# EasyEDA schematic SCH_chemical bro_2022-05-06.json
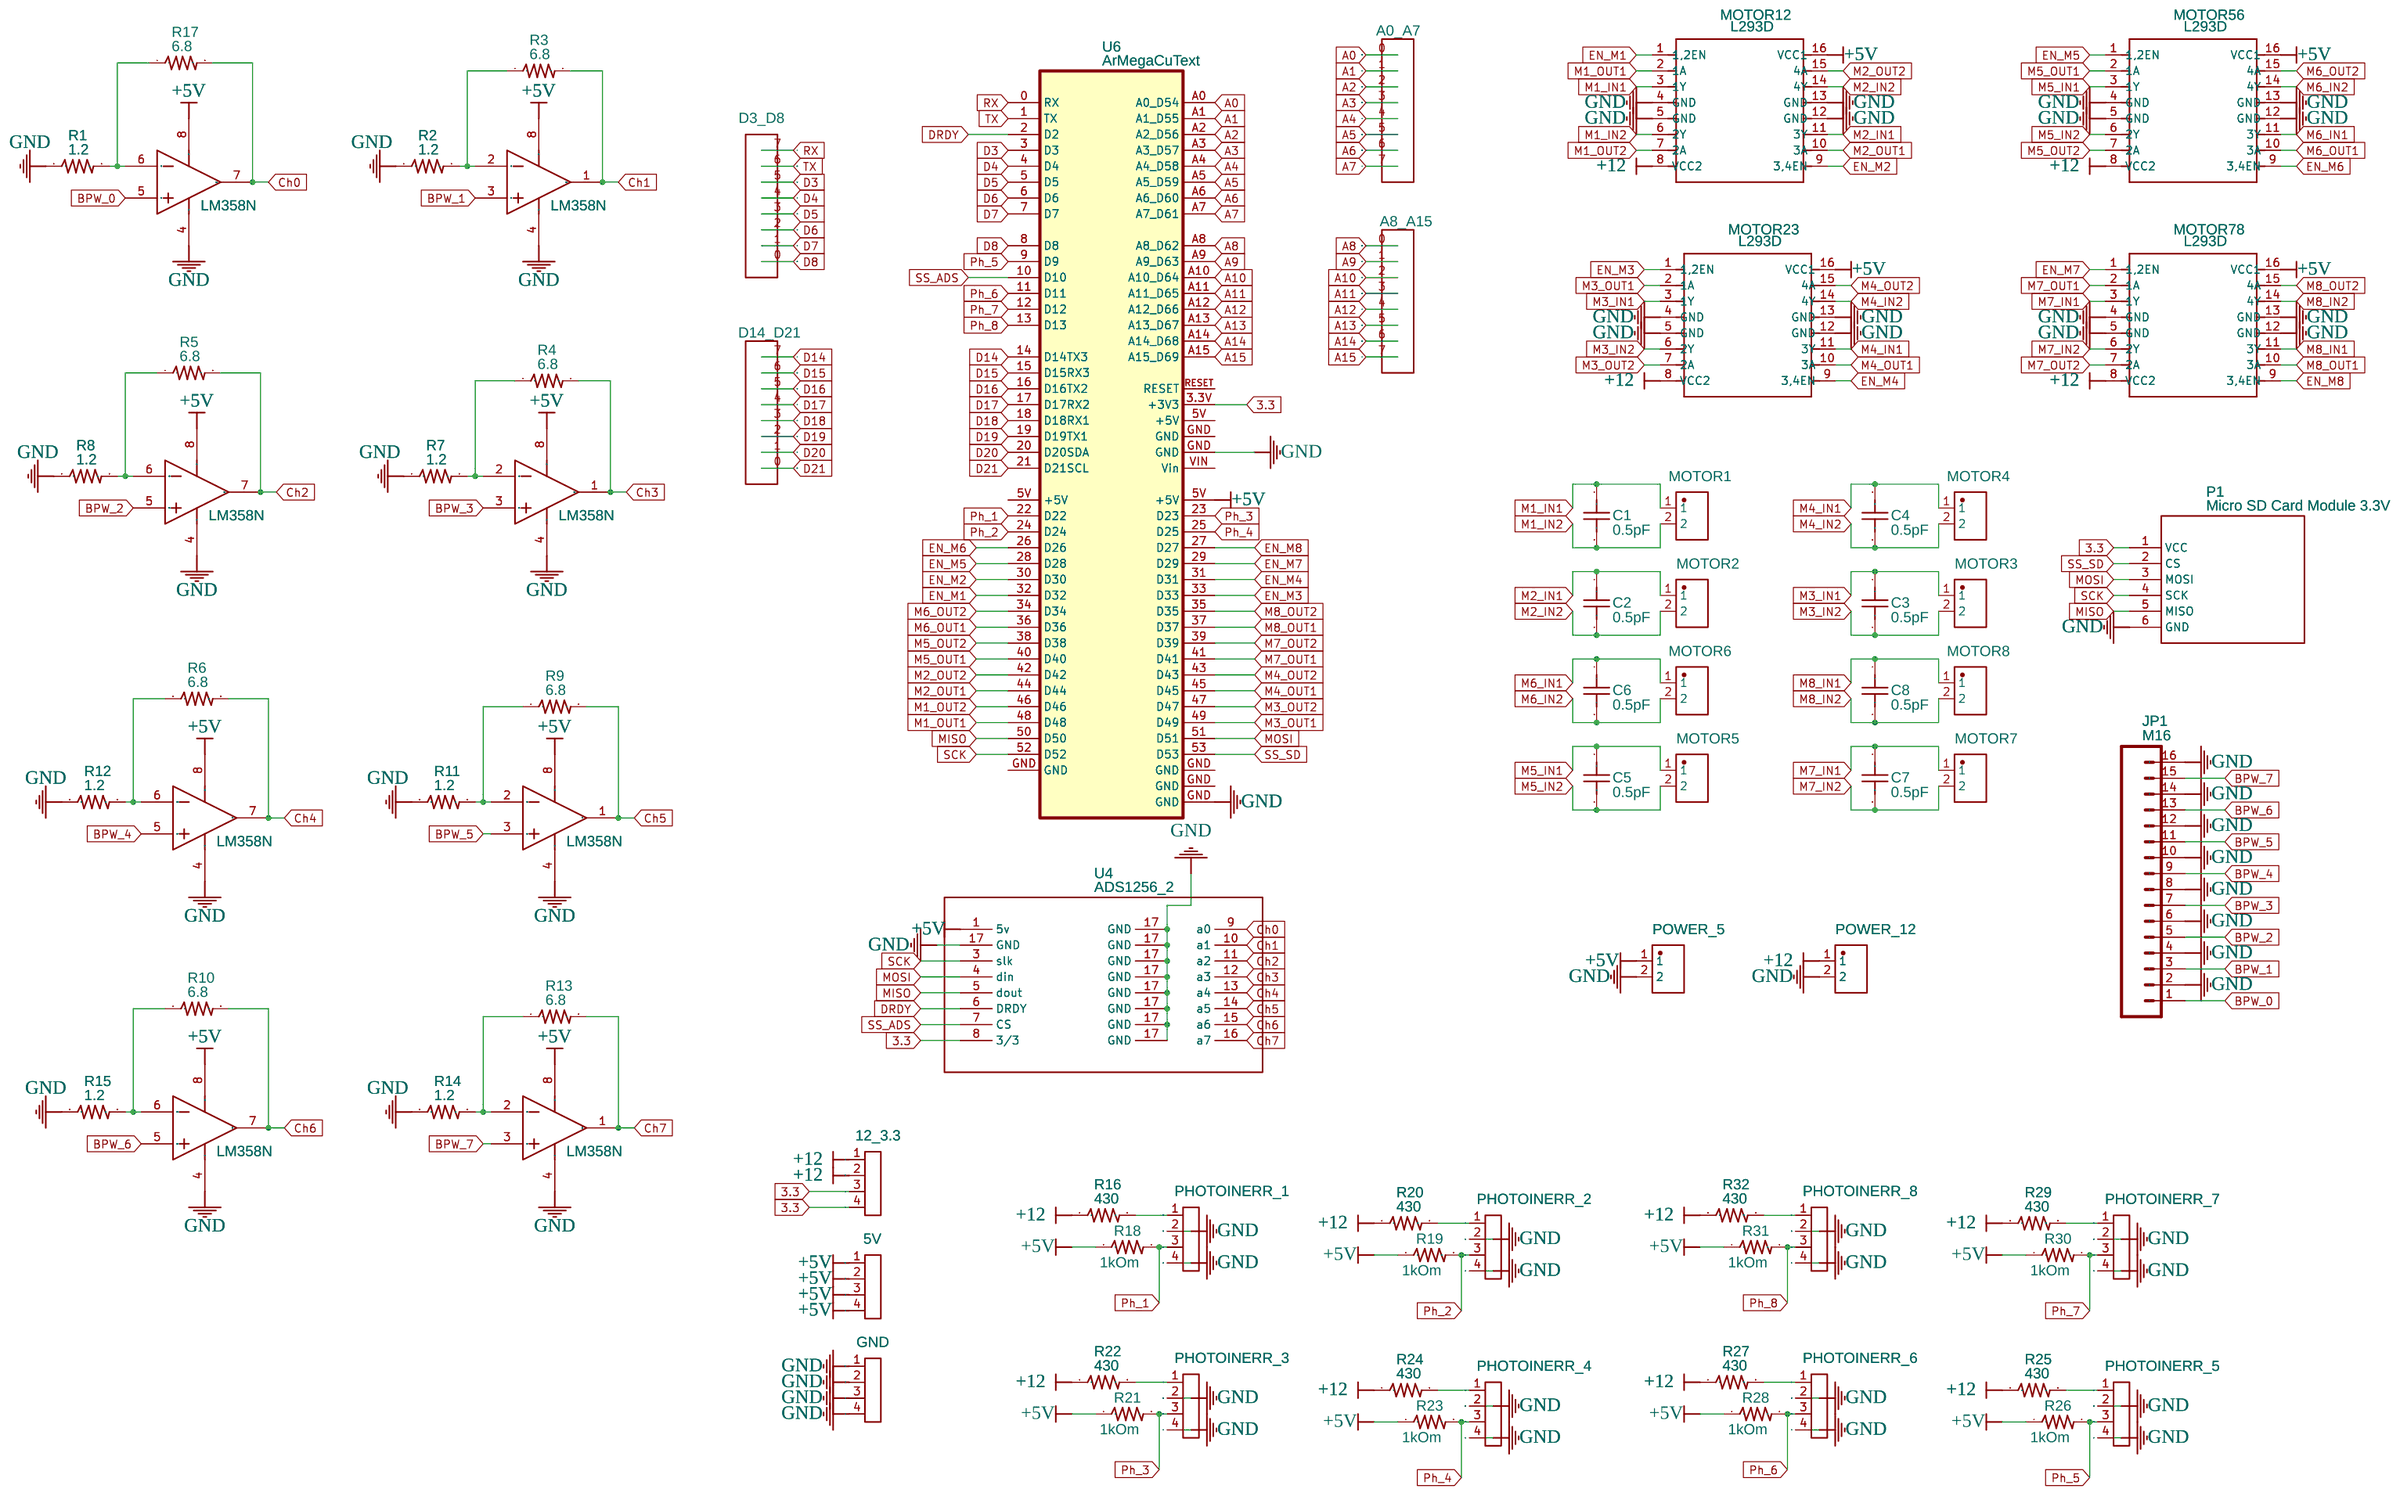
[diagram p0: schematic sheet]

## Parts
5V  pin4  [PIN4]
12_3  pin4  [PIN4]  (section 3)
A0_A7  pin8  [PIN8]
A8_A15  pin8  [PIN8]
C1  0.5pF  [CAP-TH_L5.5-W4.0-P2.50-D1.0]
C2  0.5pF  [CAP-TH_L5.5-W4.0-P2.50-D1.0]
C3  0.5pF  [CAP-TH_L5.5-W4.0-P2.50-D1.0]
C4  0.5pF  [CAP-TH_L5.5-W4.0-P2.50-D1.0]
C5  0.5pF  [CAP-TH_L5.5-W4.0-P2.50-D1.0]
C6  0.5pF  [CAP-TH_L5.5-W4.0-P2.50-D1.0]
C7  0.5pF  [CAP-TH_L5.5-W4.0-P2.50-D1.0]
C8  0.5pF  [CAP-TH_L5.5-W4.0-P2.50-D1.0]
D3_D8  pin8  [PIN8]
D14_D21  pin8  [PIN8]
GND  pin4  [PIN4]
JP1  M16  [1X16_LONGPADS]
MOTOR1  DG125-5.0-02P-14-00A(H)  [CONN-TH_DG125-5.0-02P-14-00A]
MOTOR2  DG125-5.0-02P-14-00A(H)  [CONN-TH_DG125-5.0-02P-14-00A]
MOTOR3  DG125-5.0-02P-14-00A(H)  [CONN-TH_DG125-5.0-02P-14-00A]
MOTOR4  DG125-5.0-02P-14-00A(H)  [CONN-TH_DG125-5.0-02P-14-00A]
MOTOR5  DG125-5.0-02P-14-00A(H)  [CONN-TH_DG125-5.0-02P-14-00A]
MOTOR6  DG125-5.0-02P-14-00A(H)  [CONN-TH_DG125-5.0-02P-14-00A]
MOTOR7  DG125-5.0-02P-14-00A(H)  [CONN-TH_DG125-5.0-02P-14-00A]
MOTOR8  DG125-5.0-02P-14-00A(H)  [CONN-TH_DG125-5.0-02P-14-00A]
MOTOR12  L293D  [DIP16-2.54-19.2X7.62MM]
MOTOR23  L293D  [DIP16-2.54-19.2X7.62MM]
MOTOR56  L293D  [DIP16-2.54-19.2X7.62MM]
MOTOR78  L293D  [DIP16-2.54-19.2X7.62MM]
P1  Micro SD Card Module 3.3V  [MICRO SD CARD MODULE 3.3V]
PHOTOINERR_1  pin4  [PIN4]
PHOTOINERR_2  pin4  [PIN4]
PHOTOINERR_3  pin4  [PIN4]
PHOTOINERR_4  pin4  [PIN4]
PHOTOINERR_5  pin4  [PIN4]
PHOTOINERR_6  pin4  [PIN4]
PHOTOINERR_7  pin4  [PIN4]
PHOTOINERR_8  pin4  [PIN4]
POWER_5  DG125-5.0-02P-14-00A(H)  [CONN-TH_DG125-5.0-02P-14-00A]
POWER_12  DG125-5.0-02P-14-00A(H)  [CONN-TH_DG125-5.0-02P-14-00A]
R1  1.2  [16W-RES]
R2  1.2  [16W-RES]
R3  6.8  [16W-RES]
R4  6.8  [16W-RES]
R5  6.8  [16W-RES]
R6  6.8  [16W-RES]
R7  1.2  [16W-RES]
R8  1.2  [16W-RES]
R9  6.8  [16W-RES]
R10  6.8  [16W-RES]
R11  1.2  [16W-RES]
R12  1.2  [16W-RES]
R13  6.8  [16W-RES]
R14  1.2  [16W-RES]
R15  1.2  [16W-RES]
R16  430  [16W-RES]
R17  6.8  [16W-RES]
R18  1kOm  [16W-RES]
R19  1kOm  [16W-RES]
R20  430  [16W-RES]
R21  1kOm  [16W-RES]
R22  430  [16W-RES]
R23  1kOm  [16W-RES]
R24  430  [16W-RES]
R25  430  [16W-RES]
R26  1kOm  [16W-RES]
R27  430  [16W-RES]
R28  1kOm  [16W-RES]
R29  430  [16W-RES]
R30  1kOm  [16W-RES]
R31  1kOm  [16W-RES]
R32  430  [16W-RES]
U1  LM358N  [PDIP-8_L10.2-W5.9-P2.54-LS7.6-BL]  (sections 1,2)
U2  LM358N  [PDIP-8_L10.2-W5.9-P2.54-LS7.6-BL]  (sections 1,2)
U3  LM358N  [PDIP-8_L10.2-W5.9-P2.54-LS7.6-BL]  (sections 1,2)
U4  ADS1256_2  [ADS1256(LC TECHNOLOGY)]
U5  LM358N  [PDIP-8_L10.2-W5.9-P2.54-LS7.6-BL]  (sections 1,2)
U6  ArMegaCuText  [ARDUINO_MEGA]

## Library data of the parts
5V 12_3 GND PHOTOINERR_1-PHOTOINERR_8 = pin4: Contributor: ADN-Dogan
A0_A7 A8_A15 D3_D8 D14_D21 = pin8: Contributor: WEOAN; sourceId: MuohbtL3X
C1-C8 = CC1H0R5CA1BDCH4B10MF: Supplier: LCSC; Supplier Part: C254078; Manufacturer: Dersonic; Contributor: LCSC
JP1 = M16: Contributor: SparkFun
MOTOR1-MOTOR8 POWER_5 POWER_12 = DG125-5.0-02P-14-00A(H): Supplier: LCSC; Supplier Part: C784572; Manufacturer: DEGSON; Contributor: LCSC; LCSC Assembly: Yes; SMT Type: Extend
MOTOR12 MOTOR23 MOTOR56 MOTOR78 = L293DNE: DIP IC Driver;; sourceId: qoicuM4mD
P1 = Micro SD Card Module 3.3V: sourceId: n1LFXQ8qk; Contributor: Копец Екатерина
R1-R32 = RESISTORPTH-16W: Resistor; Contributor: SparkFun
U1-U3 U5 = LM358N: Supplier: LCSC; Supplier Part: C83405; Manufacturer: Texas Instruments; subpart_no: 1; JLCPCB Part Class: Extended Part
U4 = ADS1256_2: Contributor: kopets.ekaterina
U6 = ArMegaCuText: Manufacturer Part: ArduinoMega2560; Contributor: sorinfxdx

## Nets
+5V: 5V.1 5V.2 5V.3 5V.4 MOTOR12.16(VCC1) MOTOR23.16(VCC1) MOTOR56.16(VCC1) MOTOR78.16(VCC1) POWER_5.1 R18.1 R19.1 R21.1 R23.1 R26.1 R28.1 R30.1 R31.1 U1.8(+V) U2.8(+V) U3.8(+V) U4.1(5v) U5.8(+V) U6.5V(+5V)
GND: GND.1 GND.2 GND.3 GND.4 JP1.2 JP1.4 JP1.6 JP1.8 JP1.10 JP1.12 JP1.14 JP1.16 MOTOR12.4(GND) MOTOR12.5(GND) MOTOR12.12(GND) MOTOR12.13(GND) MOTOR23.4(GND) MOTOR23.5(GND) MOTOR23.12(GND) MOTOR23.13(GND) MOTOR56.4(GND) MOTOR56.5(GND) MOTOR56.12(GND) MOTOR56.13(GND) MOTOR78.4(GND) MOTOR78.5(GND) MOTOR78.12(GND) MOTOR78.13(GND) P1.6(GND) PHOTOINERR_1.2 PHOTOINERR_1.4 PHOTOINERR_2.2 PHOTOINERR_2.4 PHOTOINERR_3.2 PHOTOINERR_3.4 PHOTOINERR_4.2 PHOTOINERR_4.4 PHOTOINERR_5.2 PHOTOINERR_5.4 PHOTOINERR_6.2 PHOTOINERR_6.4 PHOTOINERR_7.2 PHOTOINERR_7.4 PHOTOINERR_8.2 PHOTOINERR_8.4 POWER_5.2 POWER_12.2 R1.1 R2.1 R7.1 R8.1 R11.1 R12.1 R14.1 R15.1 U1.4(-V) U2.4(-V) U3.4(-V) U4.17(GND) U5.4(-V) U6.GND
3.3: 12_3.3 12_3.4 P1.1(VCC) U4.8(3/3) U6.3.3V(+3V3)
+12: 12_3.1 12_3.2 MOTOR12.8(VCC2) MOTOR23.8(VCC2) MOTOR56.8(VCC2) MOTOR78.8(VCC2) POWER_12.1 R16.1 R20.1 R22.1 R24.1 R25.1 R27.1 R29.1 R32.1
A0: A0_A7.0 U6.A0(A0 D54)
A1: A0_A7.1 U6.A1(A1 D55)
A2: A0_A7.2 U6.A2(A2 D56)
A3: A0_A7.3 U6.A3(A3 D57)
A4: A0_A7.4 U6.A4(A4 D58)
A5: A0_A7.5 U6.A5(A5 D59)
A6: A0_A7.6 U6.A6(A6 D60)
A7: A0_A7.7 U6.A7(A7 D61)
A8: A8_A15.0 U6.A8(A8 D62)
A9: A8_A15.1 U6.A9(A9 D63)
A10: A8_A15.2 U6.A10(A10 D64)
A11: A8_A15.3 U6.A11(A11 D65)
A12: A8_A15.4 U6.A12(A12 D66)
A13: A8_A15.5 U6.A13(A13 D67)
A14: A8_A15.6 U6.A14(A14 D68)
A15: A8_A15.7 U6.A15(A15 D69)
BPW_0: JP1.1 U5.5(+IN 2)
BPW_1: JP1.3 U5.3(+IN 1)
BPW_2: JP1.5 U1.5(+IN 2)
BPW_3: JP1.7 U1.3(+IN 1)
BPW_4: JP1.9 U2.5(+IN 2)
BPW_5: JP1.11 U2.3(+IN 1)
BPW_6: JP1.13 U3.5(+IN 2)
BPW_7: JP1.15 U3.3(+IN 1)
Ch0: R17.2 U4.9(a0) U5.7(OUT 2)
Ch1: R3.2 U4.10(a1) U5.1(OUT 1)
Ch2: R5.2 U1.7(OUT 2) U4.11(a2)
Ch3: R4.2 U1.1(OUT 1) U4.12(a3)
Ch4: R6.2 U2.7(OUT 2) U4.13(a4)
Ch5: R9.2 U2.1(OUT 1) U4.14(a5)
Ch6: R10.2 U3.7(OUT 2) U4.15(a6)
Ch7: R13.2 U3.1(OUT 1) U4.16(a7)
D3: D3_D8.5 U6.3(D3)
D4: D3_D8.4 U6.4(D4)
D5: D3_D8.3 U6.5(D5)
D6: D3_D8.2 U6.6(D6)
D7: D3_D8.1 U6.7(D7)
D8: D3_D8.0 U6.8(D8)
D14: D14_D21.7 U6.14(D14TX3)
D15: D14_D21.6 U6.15(D15RX3)
D16: D14_D21.5 U6.16(D16TX2)
D17: D14_D21.4 U6.17(D17RX2)
D18: D14_D21.3 U6.18(D18RX1)
D19: D14_D21.2 U6.19(D19TX1)
D20: D14_D21.1 U6.20(D20SDA)
D21: D14_D21.0 U6.21(D21SCL)
DRDY: U4.6(DRDY) U6.2(D2)
EN_M1: MOTOR12.1(1,2EN) U6.32(D32)
EN_M2: MOTOR12.9(3,4EN) U6.30(D30)
EN_M3: MOTOR23.1(1,2EN) U6.33(D33)
EN_M4: MOTOR23.9(3,4EN) U6.31(D31)
EN_M5: MOTOR56.1(1,2EN) U6.28(D28)
EN_M6: MOTOR56.9(3,4EN) U6.26(D26)
EN_M7: MOTOR78.1(1,2EN) U6.29(D29)
EN_M8: MOTOR78.9(3,4EN) U6.27(D27)
M1_IN1: C1.1 MOTOR1.1 MOTOR12.3(1Y)
M1_IN2: C1.2 MOTOR1.2 MOTOR12.6(2Y)
M1_OUT1: MOTOR12.2(1A) U6.48(D48)
M1_OUT2: MOTOR12.7(2A) U6.46(D46)
M2_IN1: C2.1 MOTOR2.1 MOTOR12.11(3Y)
M2_IN2: C2.2 MOTOR2.2 MOTOR12.14(4Y)
M2_OUT1: MOTOR12.10(3A) U6.44(D44)
M2_OUT2: MOTOR12.15(4A) U6.42(D42)
M3_IN1: C3.1 MOTOR3.1 MOTOR23.3(1Y)
M3_IN2: C3.2 MOTOR3.2 MOTOR23.6(2Y)
M3_OUT1: MOTOR23.2(1A) U6.49(D49)
M3_OUT2: MOTOR23.7(2A) U6.47(D47)
M4_IN1: C4.1 MOTOR4.1 MOTOR23.11(3Y)
M4_IN2: C4.2 MOTOR4.2 MOTOR23.14(4Y)
M4_OUT1: MOTOR23.10(3A) U6.45(D45)
M4_OUT2: MOTOR23.15(4A) U6.43(D43)
M5_IN1: C5.1 MOTOR5.1 MOTOR56.3(1Y)
M5_IN2: C5.2 MOTOR5.2 MOTOR56.6(2Y)
M5_OUT1: MOTOR56.2(1A) U6.40(D40)
M5_OUT2: MOTOR56.7(2A) U6.38(D38)
M6_IN1: C6.1 MOTOR6.1 MOTOR56.11(3Y)
M6_IN2: C6.2 MOTOR6.2 MOTOR56.14(4Y)
M6_OUT1: MOTOR56.10(3A) U6.36(D36)
M6_OUT2: MOTOR56.15(4A) U6.34(D34)
M7_IN1: C7.1 MOTOR7.1 MOTOR78.3(1Y)
M7_IN2: C7.2 MOTOR7.2 MOTOR78.6(2Y)
M7_OUT1: MOTOR78.2(1A) U6.41(D41)
M7_OUT2: MOTOR78.7(2A) U6.39(D39)
M8_IN1: C8.1 MOTOR8.1 MOTOR78.11(3Y)
M8_IN2: C8.2 MOTOR8.2 MOTOR78.14(4Y)
M8_OUT1: MOTOR78.10(3A) U6.37(D37)
M8_OUT2: MOTOR78.15(4A) U6.35(D35)
MISO: P1.5(MISO) U4.5(dout) U6.50(D50)
MOSI: P1.3(MOSI) U4.4(din) U6.51(D51)
Ph_1: PHOTOINERR_1.3 R18.2 U6.22(D22)
Ph_2: PHOTOINERR_2.3 R19.2 U6.24(D24)
Ph_3: PHOTOINERR_3.3 R21.2 U6.23(D23)
Ph_4: PHOTOINERR_4.3 R23.2 U6.25(D25)
Ph_5: PHOTOINERR_5.3 R26.2 U6.9(D9)
Ph_6: PHOTOINERR_6.3 R28.2 U6.11(D11)
Ph_7: PHOTOINERR_7.3 R30.2 U6.12(D12)
Ph_8: PHOTOINERR_8.3 R31.2 U6.13(D13)
RX: D3_D8.7 U6.0(RX)
SCK: P1.4(SCK) U4.3(slk) U6.52(D52)
SS_ADS: U4.7(CS) U6.10(D10)
SS_SD: P1.2(CS) U6.53(D53)
TX: D3_D8.6 U6.1(TX)
Net-(PHOTOINERR_1-1): PHOTOINERR_1.1 R16.2
Net-(PHOTOINERR_2-1): PHOTOINERR_2.1 R20.2
Net-(PHOTOINERR_3-1): PHOTOINERR_3.1 R22.2
Net-(PHOTOINERR_4-1): PHOTOINERR_4.1 R24.2
Net-(PHOTOINERR_5-1): PHOTOINERR_5.1 R25.2
Net-(PHOTOINERR_6-1): PHOTOINERR_6.1 R27.2
Net-(PHOTOINERR_7-1): PHOTOINERR_7.1 R29.2
Net-(PHOTOINERR_8-1): PHOTOINERR_8.1 R32.2
Net-(R1-2): R1.2 R17.1 U5.6(-IN 2)
Net-(R2-2): R2.2 R3.1 U5.2(-IN 1)
Net-(R4-1): R4.1 R7.2 U1.2(-IN 1)
Net-(R5-1): R5.1 R8.2 U1.6(-IN 2)
Net-(R6-1): R6.1 R12.2 U2.6(-IN 2)
Net-(R9-1): R9.1 R11.2 U2.2(-IN 1)
Net-(R10-1): R10.1 R15.2 U3.6(-IN 2)
Net-(R13-1): R13.1 R14.2 U3.2(-IN 1)

Not connected (* = marked no-connect by the designer): U6 RESET VIN(Vin)
